# Altium project Dynamics Module v2.0.0.PrjPcb
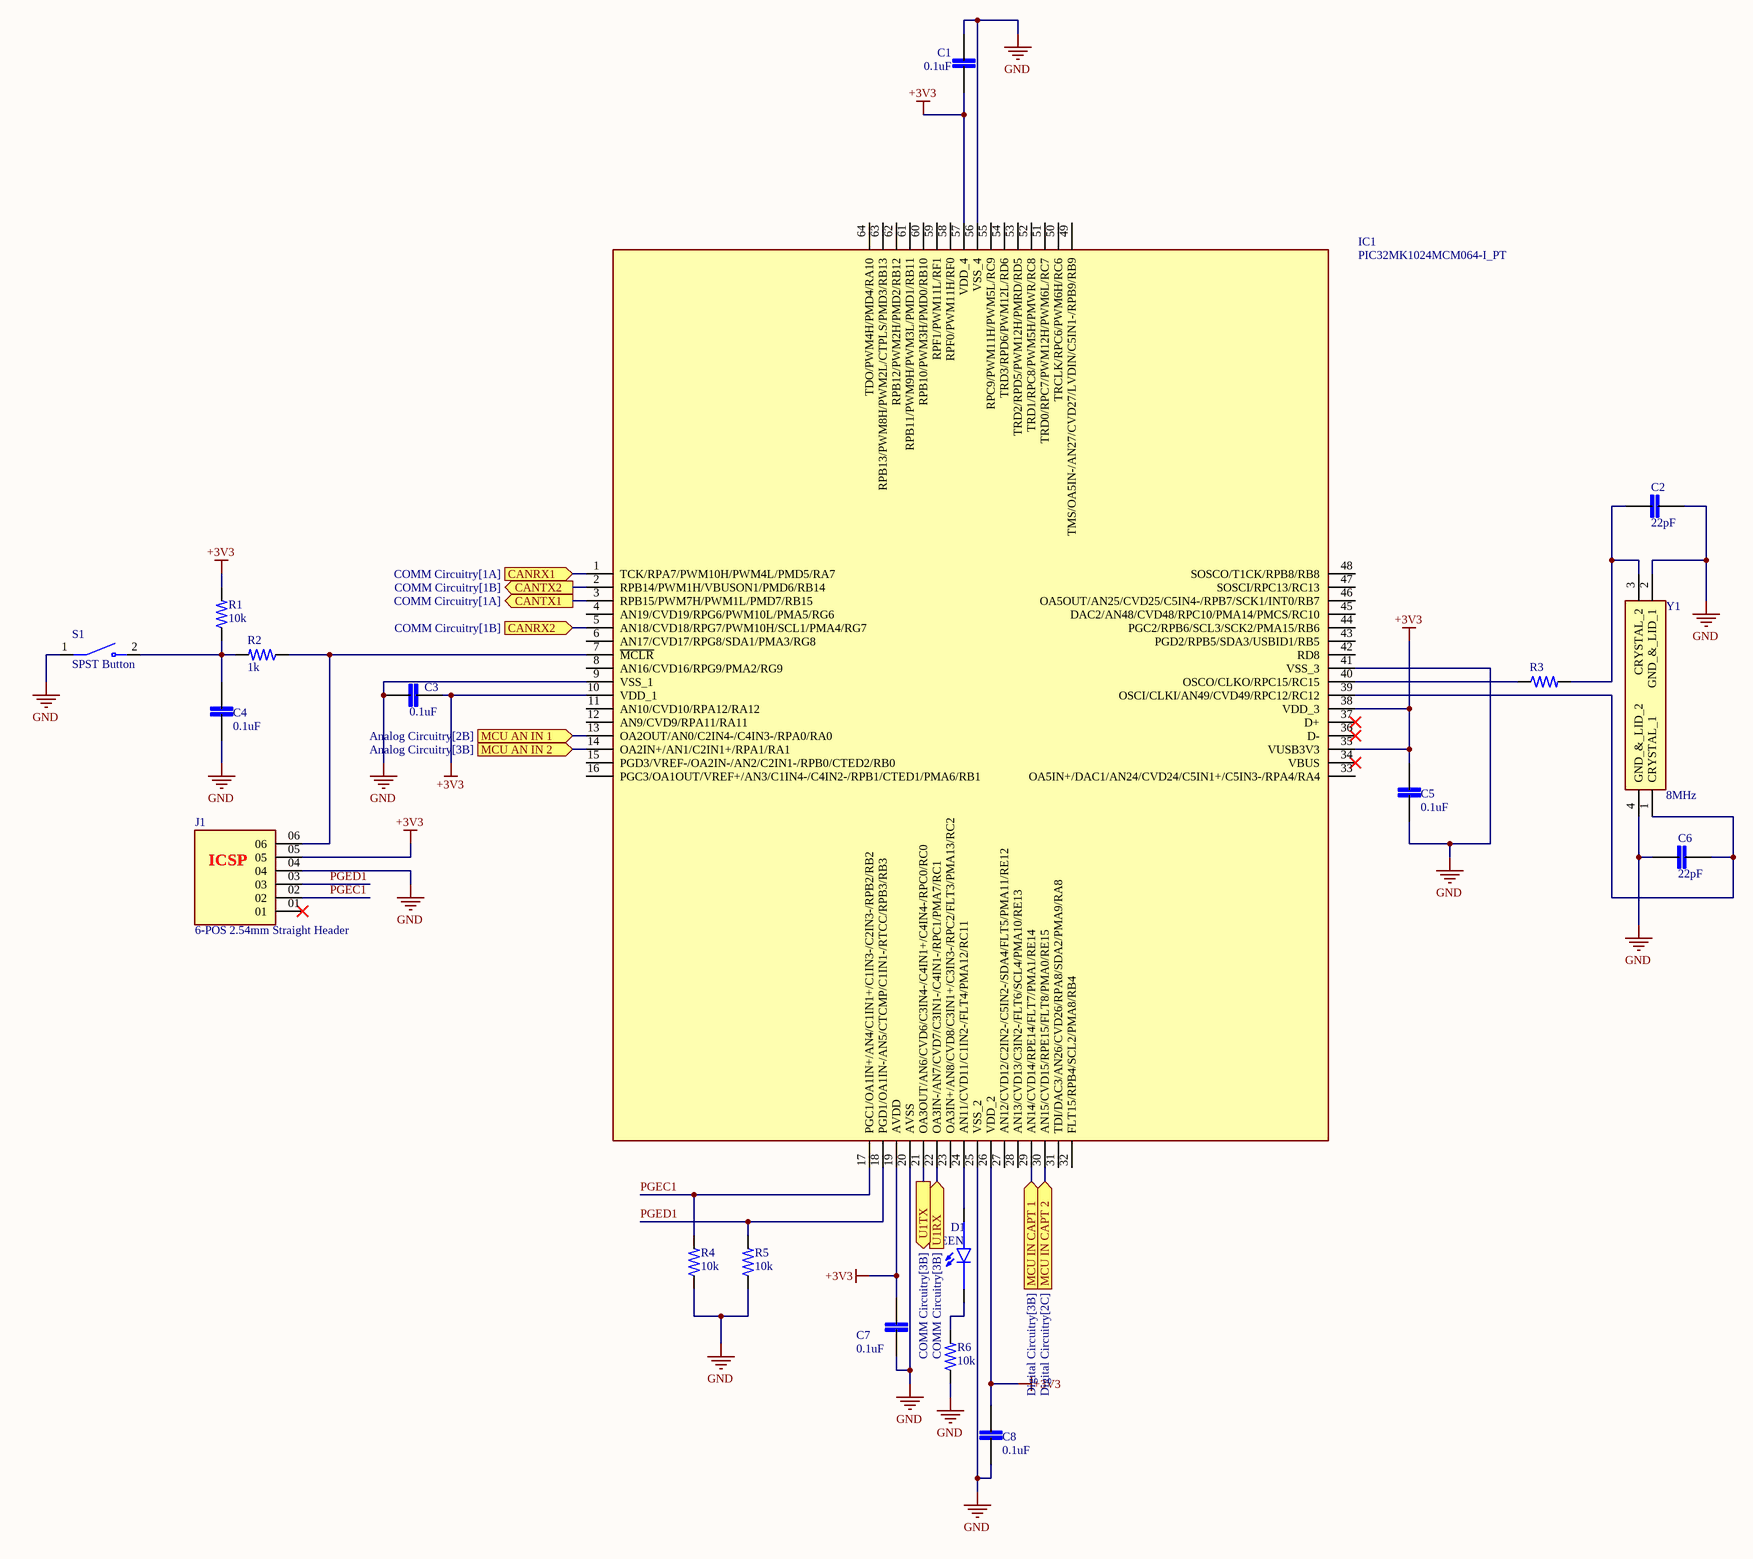
[diagram p0: PIC32MK1024MCM064.SchDoc]
6 sheets, 62 parts. Net scope: flat (ports and power ports of the same name join across sheets).
Board file: Dynamics Module v2.0.0.PcbDoc
Sheets:
  PIC32MK1024MCM064.SchDoc
  Analog Circuitry.SchDoc
  Digital Circuitry.SchDoc
  Power Circuitry.SchDoc
  COMM Circuitry.SchDoc
  Connector.SchDoc

## Sheet PIC32MK1024MCM064.SchDoc
size A2; SheetNumber: 1; SheetTotal: 6

### Parts
C1  0.1uF  [0805]
C2  22pF  [0805]
C3  0.1uF  [0805]
C4  0.1uF  [0805]
C5  0.1uF  [0805]
C6  22pF  [0805]
C7  0.1uF  [0805]
C8  0.1uF  [0805]
D1  GREEN  [LED 0805]
IC1  PIC32MK1024MCM064-I_PT  [PIC32MK1024MCM064-I_PT]
J1  6-POS 2.54mm Straight Header  [6-POS 2.54mm Header]
R1  10k  [0805]
R2  1k  [0805]
R3  0805_Resistor  [0805]  (value not drawn)
R4  10k  [0805]
R5  10k  [0805]
R6  10k  [0805]
S1  SPST Button  [SPST Button]
Y1  8MHz  [Crystal 5x3.2 - 4Pads]

### Ports
CANRX1 (in, see COMM Circuitry[1A]), CANRX2 (in, see COMM Circuitry[1B]), CANTX1 (out, see COMM Circuitry[1A]), CANTX2 (out, see COMM Circuitry[1B]), MCU AN IN 1 (in, see Analog Circuitry[2B]), MCU AN IN 2 (in, see Analog Circuitry[3B]), MCU IN CAPT 1 (in, see Digital Circuitry[3B]), MCU IN CAPT 2 (in, see Digital Circuitry[2C]), U1RX (in, see COMM Circuitry[3B]), U1TX (out, see COMM Circuitry[3B])

### Nets
+3V3: C1.2 C3.1 C5.2 C7.2 C8.2 IC1.10(VDD_1) IC1.19(AVDD) IC1.26(VDD_2) IC1.35(VUSB3V3) IC1.38(VDD_3) IC1.57(VDD_4) J1.05 R1.2
GND: C1.1 C2.2 C3.2 C4.1 C5.1 C6.1 C7.1 C8.1 IC1.9(VSS_1) IC1.20(AVSS) IC1.25(VSS_2) IC1.41(VSS_3) IC1.56(VSS_4) J1.04 R4.1 R5.1 R6.1 S1.1 Y1.2(GND_&_LID_1) Y1.4(GND_&_LID_2)
PGEC1: IC1.17(PGC1/OA1IN+/AN4/C1IN1+/C1IN3-/C2IN3-/RPB2/RB2) J1.02 R4.2
PGED1: IC1.18(PGD1/OA1IN-/AN5/CTCMP/C1IN1-/RTCC/RPB3/RB3) J1.03 R5.2
NetC2_1: C2.1 R3.2 Y1.3(CRYSTAL_2)
NetC4_2: C4.2 R1.1 R2.2 S1.2
NetC6_2: C6.2 IC1.39(OSCI/CLKI/AN49/CVD49/RPC12/RC12) Y1.1(CRYSTAL_1)
NetD1_A: D1.A IC1.24(AN11/CVD11/C1IN2-/FLT4/PMA12/RC11)
NetD1_C: D1.C R6.2
NetIC1_1: IC1.1(TCK/RPA7/PWM10H/PWM4L/PMD5/RA7) ; port CANRX1
NetIC1_2: IC1.2(RPB14/PWM1H/VBUSON1/PMD6/RB14) ; port CANTX2
NetIC1_3: IC1.3(RPB15/PWM7H/PWM1L/PMD7/RB15) ; port CANTX1
NetIC1_5: IC1.5(AN18/CVD18/RPG7/PWM10H/SCL1/PMA4/RG7) ; port CANRX2
NetIC1_7: IC1.7(~{MCLR}) J1.06 R2.1
NetIC1_13: IC1.13(OA2OUT/AN0/C2IN4-/C4IN3-/RPA0/RA0) ; port MCU AN IN 1
NetIC1_14: IC1.14(OA2IN+/AN1/C2IN1+/RPA1/RA1) ; port MCU AN IN 2
NetIC1_21: IC1.21(OA3OUT/AN6/CVD6/C3IN4-/C4IN1+/C4IN4-/RPC0/RC0) ; port U1TX
NetIC1_22: IC1.22(OA3IN-/AN7/CVD7/C3IN1-/C4IN1-/RPC1/PMA7/RC1) ; port U1RX
NetIC1_29: IC1.29(AN14/CVD14/RPE14/FLT7/PMA1/RE14) ; port MCU IN CAPT 1
NetIC1_30: IC1.30(AN15/CVD15/RPE15/FLT8/PMA0/RE15) ; port MCU IN CAPT 2
NetIC1_40: IC1.40(OSCO/CLKO/RPC15/RC15) R3.1

Not connected (* = marked no-connect by the designer): IC1 4(AN19/CVD19/RPG6/PWM10L/PMA5/RG6) 6(AN17/CVD17/RPG8/SDA1/PMA3/RG8) 8(AN16/CVD16/RPG9/PMA2/RG9) 11(AN10/CVD10/RPA12/RA12) 12(AN9/CVD9/RPA11/RA11) 15(PGD3/VREF-/OA2IN-/AN2/C2IN1-/RPB0/CTED2/RB0) 16(PGC3/OA1OUT/VREF+/AN3/C1IN4-/C4IN2-/RPB1/CTED1/PMA6/RB1) 23(OA3IN+/AN8/CVD8/C3IN1+/C3IN3-/RPC2/FLT3/PMA13/RC2) 27(AN12/CVD12/C2IN2-/C5IN2-/SDA4/FLT5/PMA11/RE12) 28(AN13/CVD13/C3IN2-/FLT6/SCL4/PMA10/RE13) 31(TDI/DAC3/AN26/CVD26/RPA8/SDA2/PMA9/RA8) 32(FLT15/RPB4/SCL2/PMA8/RB4) 33(OA5IN+/DAC1/AN24/CVD24/C5IN1+/C5IN3-/RPA4/RA4) 34(VBUS)* 36(D-)* 37(D+)* 42(RD8) 43(PGD2/RPB5/SDA3/USBID1/RB5) 44(PGC2/RPB6/SCL3/SCK2/PMA15/RB6) 45(DAC2/AN48/CVD48/RPC10/PMA14/PMCS/RC10) 46(OA5OUT/AN25/CVD25/C5IN4-/RPB7/SCK1/INT0/RB7) 47(SOSCI/RPC13/RC13) 48(SOSCO/T1CK/RPB8/RB8) 49(TMS/OA5IN-/AN27/CVD27/LVDIN/C5IN1-/RPB9/RB9) 50(TRCLK/RPC6/PWM6H/RC6) 51(TRD0/RPC7/PWM12H/PWM6L/RC7) 52(TRD1/RPC8/PWM5H/PMWR/RC8) 53(TRD2/RPD5/PWM12H/PMRD/RD5) 54(TRD3/RPD6/PWM12L/RD6) 55(RPC9/PWM11H/PWM5L/RC9) 58(RPF0/PWM11H/RF0) 59(RPF1/PWM11L/RF1) 60(RPB10/PWM3H/PMD0/RB10) 61(RPB11/PWM9H/PWM3L/PMD1/RB11) 62(RPB12/PWM2H/PMD2/RB12) 63(RPB13/PWM8H/PWM2L/CTPLS/PMD3/RB13) 64(TDO/PWM4H/PMD4/RA10); J1 01*

### Notes on the sheet
- (near J1) ICSP

### Library data of the parts
C1-C8 = 0805_Capacitor: MP: LD051A121KAB2A; MF: AVX; SnapEDA_Link: https://www.snapeda.com/parts/LD051A121KAB2A/AVX/view-part/?ref=snap; Package: 0805 AVX; Check_prices: https://www.snapeda.com/parts/LD051A121KAB2A/AVX/view-part/?ref=eda; Purchase-URL: https://pricing.snapeda.com/search/part/LD051A121KAB2A/?ref=eda; Price: None; Value: *; Availability: In Stock
D1 = LED 0805: LED Uni-Color Green 4-Pin Chip 0805 T/R; MP: 597-3305-607F; Availability: Unavailable; Value: *; Price: None; Package: None
IC1 = PIC32MK1024MCM064-I_PT: Integrated Circuit; Manufacturer_Name: Microchip; Manufacturer_Part_Number: PIC32MK1024MCM064-I/PT; Datasheet Link: https://ww1.microchip.com/downloads/aemDocuments/documents/MCU32/ProductDocuments/DataSheets/PIC32MK-GPK-MCM-with-CAN-FD-Family-DataSheet-DS60001519E.pdf; Height: 1.2mm; Mouser Part Number: 579-2MK1024MCM064IPT; Mouser Price/Stock: https://www.mouser.co.uk/ProductDetail/Microchip-Technology/PIC32MK1024MCM064-I-PT?qs=W%2FMpXkg%252BdQ4dBI32NJdQMg%3D%3D; Arrow Part Number: PIC32MK1024MCM064-I/PT; Arrow Price/Stock: https://www.arrow.com/en/products/pic32mk1024mcm064-ipt/microchip-technology?region=nac
J1 = 6-POS 2.54mm Straight Header: HEADER, 6 CONTACTS, 1 ROW, THROUGH HOLE, 2.54 MM; Connector Systems:Board-to-Board; Pitch Spacing:2.54mm; No. of Rows:1Rows; No. of Contacts:6Contacts; Contact Termination Type:Through Hole Right Angle; Product Range:HTSW Series RoHS Compliant: Yes; MP: HTSW10608SSLA; MF: Samtec; Purchase-URL: https://pricing.snapeda.com/search/part/HTSW10608SSLA/?ref=eda; Package: None; Check_prices: https://www.snapeda.com/parts/HTSW10608SSLA/Samtec/view-part/?ref=eda; Price: None; SnapEDA_Link: https://www.snapeda.com/parts/HTSW10608SSLA/Samtec/view-part/?ref=snap; Availability: In Stock; Value: *
R1-R6 = 0805_Resistor: Power_Rating: .25 W; MP: 2-2176053-0; Tolerance: 1%; Resistance: .33; MF: TE Connectivity; Price: None; Availability: In Stock; EU_RoHS_Compliance: Compliant with Exemptions; Package: 0805; Value: *; SnapEDA_Link: https://www.snapeda.com/parts/2-2176053-0/TE+Connectivity/view-part/?ref=snap; Check_prices: https://www.snapeda.com/parts/2-2176053-0/TE+Connectivity/view-part/?ref=eda
S1 = SPST Button: 3mmX6mm; MP: B3U-1000P; Price: None; Availability: Unavailable; Value: *; Package: None
Y1 = Crystal 5x3.2 - 4Pads: Crystal or Oscillator; Manufacturer_Name: Wurth Elektronik; Manufacturer_Part_Number: 830106162701; Datasheet Link: https://www.we-online.com/components/products/datasheet/830106162701.pdf; Height: 1mm; Mouser Part Number: 710-830106162701; Mouser Price/Stock: https://www.mouser.co.uk/ProductDetail/Wurth-Elektronik/830106162701?qs=hd1VzrDQEGiB2nVeND4SIw%3D%3D

## Sheet Analog Circuitry.SchDoc
size A4; SheetNumber: 2; SheetTotal: 6
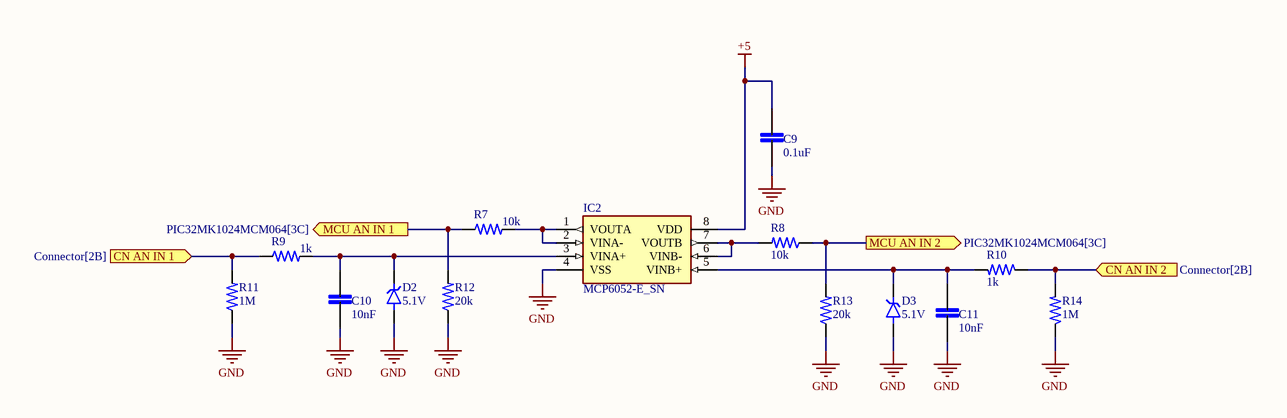
[diagram p1: Analog Circuitry.SchDoc]

### Parts
C9  0.1uF  [0805]
C10  10nF  [0805]
C11  10nF  [0805]
D2  5.1V  [SOD323]
D3  5.1V  [SOD323]
IC2  MCP6052-E_SN  [MCP6052-E_SN]
R7  10k  [0805]
R8  10k  [0805]
R9  1k  [0805]
R10  1k  [0805]
R11  1M  [0805]
R12  20k  [0805]
R13  20k  [0805]
R14  1M  [0805]

### Ports
CN AN IN 1 (in, see Connector[2B]), CN AN IN 2 (in, see Connector[2B]), MCU AN IN 1 (out, see PIC32MK1024MCM064[3C]), MCU AN IN 2 (out, see PIC32MK1024MCM064[3C])

### Nets
+5: C9.2 IC2.8(VDD)
GND: C9.1 C10.1 C11.1 D2.2(A) D3.2(A) IC2.4(VSS) R11.1 R12.1 R13.1 R14.1
NetC10_2: C10.2 D2.1(K) IC2.3(VINA+) R9.2
NetC11_2: C11.2 D3.1(K) IC2.5(VINB+) R10.2
NetIC1_13: R7.1 R12.2 ; port MCU AN IN 1
NetIC1_14: R8.1 R13.2 ; port MCU AN IN 2
NetIC2_1: IC2.1(VOUTA) IC2.2(VINA-) R7.2
NetIC2_6: IC2.6(VINB-) IC2.7(VOUTB) R8.2
NetJ3_2: R9.1 R11.2 ; port CN AN IN 1
NetJ3_5: R10.1 R14.2 ; port CN AN IN 2

### Library data of the parts
C9-C11 = 0805_Capacitor: MP: LD051A121KAB2A; MF: AVX; SnapEDA_Link: https://www.snapeda.com/parts/LD051A121KAB2A/AVX/view-part/?ref=snap; Package: 0805 AVX; Check_prices: https://www.snapeda.com/parts/LD051A121KAB2A/AVX/view-part/?ref=eda; Purchase-URL: https://pricing.snapeda.com/search/part/LD051A121KAB2A/?ref=eda; Price: None; Value: *; Availability: In Stock
D2 D3 = SOD323 - Zener Diode: MP: 1SMA5926; MF: Taiwan Semiconductor; Package: SMA-2 Taiwan Semiconductor; Availability: In Stock; Purchase-URL: https://pricing.snapeda.com/search/part/1SMA5926/?ref=eda; SnapEDA_Link: https://www.snapeda.com/parts/1SMA5926/Taiwan+Semiconductor/view-part/?ref=snap; Price: None; Check_prices: https://www.snapeda.com/parts/1SMA5926/Taiwan+Semiconductor/view-part/?ref=eda; Value: *
IC2 = MCP6052-E_SN: Integrated Circuit; Manufacturer_Name: Microchip; Manufacturer_Part_Number: MCP6052-E/SN; Datasheet Link: http://ww1.microchip.com/downloads/en/DeviceDoc/MCP6051_DS22182B.pdf; Height: 1.75mm; Mouser Part Number: 579-MCP6052-E/SN; Mouser Price/Stock: https://www.mouser.com/Search/Refine.aspx?Keyword=579-MCP6052-E%2FSN
R7-R14 = 0805_Resistor: as R1 on sheet PIC32MK1024MCM064; Price: None; Availability: In Stock; EU_RoHS_Compliance: Compliant with Exemptions; Package: 0805; Value: *; SnapEDA_Link: https://www.snapeda.com/parts/2-2176053-0/TE+Connectivity/view-part/?ref=snap; Check_prices: https://www.snapeda.com/parts/2-2176053-0/TE+Connectivity/view-part/?ref=eda

## Sheet Digital Circuitry.SchDoc
size A4; SheetNumber: 3; SheetTotal: 6
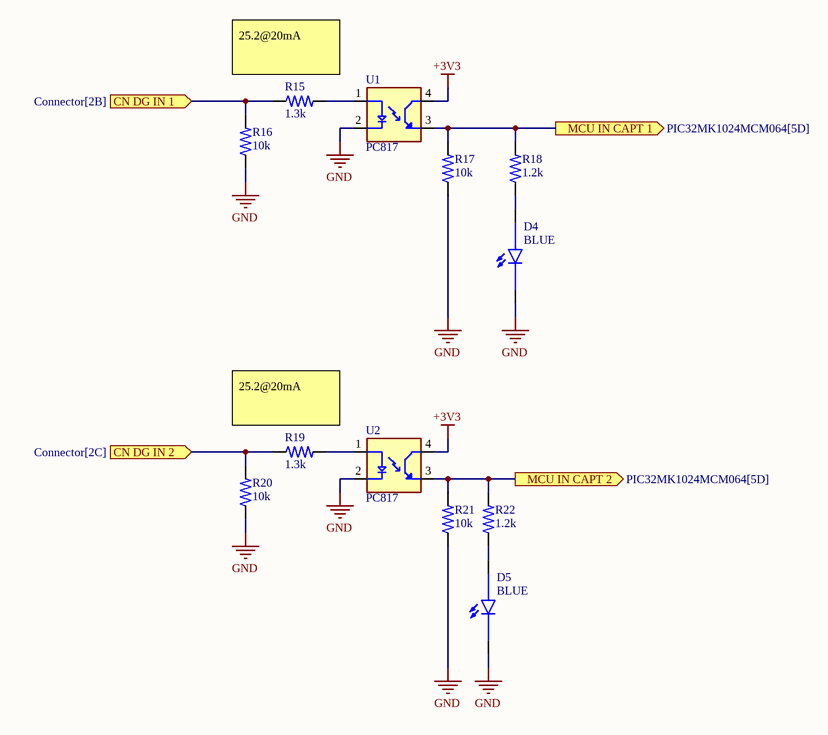
[diagram p2: Digital Circuitry.SchDoc]

### Parts
D4  BLUE  [LED 0805]
D5  BLUE  [LED 0805]
R15  1.3k  [0805]
R16  10k  [0805]
R17  10k  [0805]
R18  1.2k  [0805]
R19  1.3k  [0805]
R20  10k  [0805]
R21  10k  [0805]
R22  1.2k  [0805]
U1  PC817  [PC817]
U2  PC817  [PC817]

### Ports
CN DG IN 1 (in, see Connector[2B]), CN DG IN 2 (in, see Connector[2C]), MCU IN CAPT 1 (out, see PIC32MK1024MCM064[5D]), MCU IN CAPT 2 (out, see PIC32MK1024MCM064[5D])

### Nets
+3V3: U1.4(CT) U2.4(CT)
GND: D4.C D5.C R16.1 R17.1 R20.1 R21.1 U1.2(C) U2.2(C)
NetD4_A: D4.A R18.1
NetD5_A: D5.A R22.1
NetIC1_29: R17.2 R18.2 U1.3(ET) ; port MCU IN CAPT 1
NetIC1_30: R21.2 R22.2 U2.3(ET) ; port MCU IN CAPT 2
NetJ3_8: R15.1 R16.2 ; port CN DG IN 1
NetJ3_11: R19.1 R20.2 ; port CN DG IN 2
NetR15_2: R15.2 U1.1(A)
NetR19_2: R19.2 U2.1(A)

### Notes on the sheet
- 25.2@20mA

### Library data of the parts
D4 D5 = LED 0805: as D1 on sheet PIC32MK1024MCM064; Availability: Unavailable; Value: *; Price: None; Package: None
R15-R22 = 0805_Resistor: as R1 on sheet PIC32MK1024MCM064; Price: None; Availability: In Stock; EU_RoHS_Compliance: Compliant with Exemptions; Package: 0805; Value: *; SnapEDA_Link: https://www.snapeda.com/parts/2-2176053-0/TE+Connectivity/view-part/?ref=snap; Check_prices: https://www.snapeda.com/parts/2-2176053-0/TE+Connectivity/view-part/?ref=eda
U1 U2 = PC817: Optoisolator Transistor Output 5000Vrms 1 Channel 4-SMD; MP: PC817XI; MF: Sharp Microelectronics; Price: None; Availability: In Stock; Package: SMD-4 Sharp Microelectronics; Value: *; SnapEDA_Link: https://www.snapeda.com/parts/PC817XI/Sharp+Microelectronics/view-part/?ref=snap; Purchase-URL: https://pricing.snapeda.com/search/part/PC817XI/?ref=eda; Check_prices: https://www.snapeda.com/parts/PC817XI/Sharp+Microelectronics/view-part/?ref=eda

## Sheet Power Circuitry.SchDoc
size A4; SheetNumber: 4; SheetTotal: 6
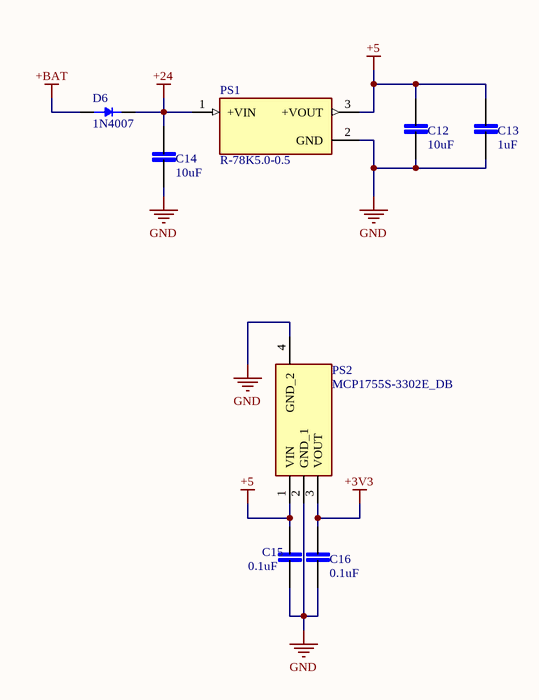
[diagram p3: Power Circuitry.SchDoc]

### Parts
C12  10uF  [0805]
C13  1uF  [0805]
C14  10uF  [0805]
C15  0.1uF  [0805]
C16  0.1uF  [0805]
D6  1N4007  [SOD123]
PS1  R-78K5.0-0.5  [CONV_R-78K5.0-0.5]
PS2  MCP1755S-3302E_DB  [MCP1755S-3302E_DB]

### Nets
+3V3: C16.2 PS2.3(VOUT)
+5: C12.2 C13.2 C15.2 PS1.3(+VOUT) PS2.1(VIN)
+24: C14.2 D6.2(A) PS1.1(+VIN)
+BAT: D6.1(K)
GND: C12.1 C13.1 C14.1 C15.1 C16.1 PS1.2(GND) PS2.2(GND_1) PS2.4(GND_2)

### Library data of the parts
C12-C16 = 0805_Capacitor: MP: LD051A121KAB2A; MF: AVX; SnapEDA_Link: https://www.snapeda.com/parts/LD051A121KAB2A/AVX/view-part/?ref=snap; Package: 0805 AVX; Check_prices: https://www.snapeda.com/parts/LD051A121KAB2A/AVX/view-part/?ref=eda; Purchase-URL: https://pricing.snapeda.com/search/part/LD051A121KAB2A/?ref=eda; Price: None; Value: *; Availability: In Stock
D6 = SOD123 - Rectifier Diode: MF: Diodes Inc.; MP: 1N4148W-7-F; Value: *; Availability: In Stock; Package: SOD-123 Fairchild Semiconductor; SnapEDA_Link: https://www.snapeda.com/parts/1N4148W-7-F/Diodes+Inc./view-part/?ref=snap; Price: None; Check_prices: https://www.snapeda.com/parts/1N4148W-7-F/Diodes+Inc./view-part/?ref=eda; Purchase-URL: https://pricing.snapeda.com/search/part/1N4148W-7-F/?ref=eda
PS1 = R-78K5.0-0.5: 0.5A DC/DC-Converter 'INNOLINE' SIP3 reg; MF: Recom Power; Package: None; Value: *; Check_prices: https://www.snapeda.com/parts/R-78K5.0-0.5/Recom+Power/view-part/?ref=eda; Purchase-URL: https://pricing.snapeda.com/search/part/R-78K5.0-0.5/?ref=eda; Availability: In Stock; SnapEDA_Link: https://www.snapeda.com/parts/R-78K5.0-0.5/Recom+Power/view-part/?ref=snap; Price: None; MP: R-78K5.0-0.5
PS2 = MCP1755S-3302E_DB: Power Supply; Manufacturer_Name: Microchip; Manufacturer_Part_Number: MCP1755S-3302E/DB; Datasheet Link: http://www.farnell.com/datasheets/1697992.pdf; Height: 1.8mm; Mouser Part Number: 579-MCP1755S-3302EDB; Mouser Price/Stock: https://www.mouser.co.uk/ProductDetail/Microchip-Technology/MCP1755S-3302E-DB?qs=OCR3PNzn1cc7Hxpx9CIZgA%3D%3D; Arrow Part Number: MCP1755S-3302E/DB; Arrow Price/Stock: https://www.arrow.com/en/products/mcp1755s-3302edb/microchip-technology?region=nac

## Sheet COMM Circuitry.SchDoc
size A4; SheetNumber: 5; SheetTotal: 6
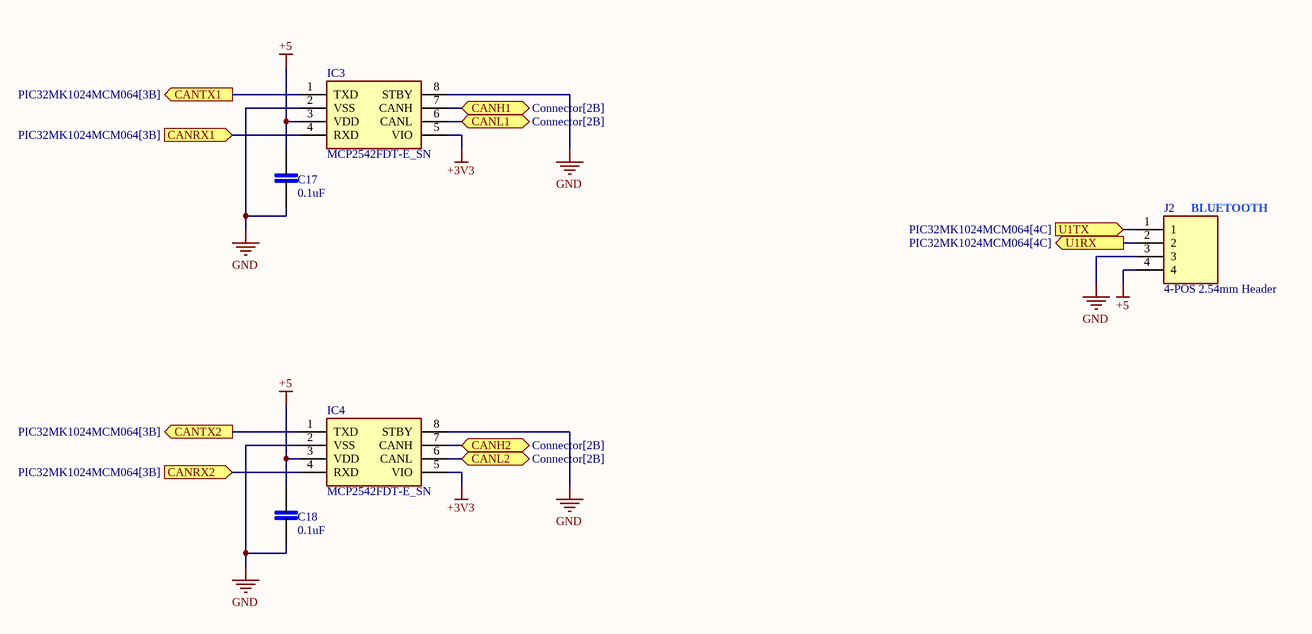
[diagram p4: COMM Circuitry.SchDoc]

### Parts
C17  0.1uF  [0805]
C18  0.1uF  [0805]
IC3  MCP2542FDT-E_SN  [MCP2542FDT-E_SN]
IC4  MCP2542FDT-E_SN  [MCP2542FDT-E_SN]
J2  4-POS 2.54mm Header  [4-POS 2.54mm Header]

### Ports
CANH1 (bidir, see Connector[2B]), CANH2 (bidir, see Connector[2B]), CANL1 (bidir, see Connector[2B]), CANL2 (bidir, see Connector[2B]), CANRX1 (in, see PIC32MK1024MCM064[3B]), CANRX2 (in, see PIC32MK1024MCM064[3B]), CANTX1 (out, see PIC32MK1024MCM064[3B]), CANTX2 (out, see PIC32MK1024MCM064[3B]), U1RX (out, see PIC32MK1024MCM064[4C]), U1TX (in, see PIC32MK1024MCM064[4C])

### Nets
+3V3: IC3.5(VIO) IC4.5(VIO)
+5: C17.2 C18.2 IC3.3(VDD) IC4.3(VDD) J2.4
GND: C17.1 C18.1 IC3.2(VSS) IC3.8(STBY) IC4.2(VSS) IC4.8(STBY) J2.3
NetIC1_1: IC3.4(RXD) ; port CANRX1
NetIC1_2: IC4.1(TXD) ; port CANTX2
NetIC1_3: IC3.1(TXD) ; port CANTX1
NetIC1_5: IC4.4(RXD) ; port CANRX2
NetIC1_21: J2.1 ; port U1TX
NetIC1_22: J2.2 ; port U1RX
NetIC3_6: IC3.6(CANL) ; port CANL1
NetIC3_7: IC3.7(CANH) ; port CANH1
NetIC4_6: IC4.6(CANL) ; port CANL2
NetIC4_7: IC4.7(CANH) ; port CANH2

### Notes on the sheet
- (near J2) BLUETOOTH

### Library data of the parts
C17 C18 = 0805_Capacitor: MP: LD051A121KAB2A; MF: AVX; SnapEDA_Link: https://www.snapeda.com/parts/LD051A121KAB2A/AVX/view-part/?ref=snap; Package: 0805 AVX; Check_prices: https://www.snapeda.com/parts/LD051A121KAB2A/AVX/view-part/?ref=eda; Purchase-URL: https://pricing.snapeda.com/search/part/LD051A121KAB2A/?ref=eda; Price: None; Value: *; Availability: In Stock
IC3 IC4 = MCP2542FDT-E_SN: Integrated Circuit; Manufacturer_Name: Microchip; Manufacturer_Part_Number: MCP2542FDT-E/SN; Datasheet Link: https://ww1.microchip.com/downloads/en/DeviceDoc/MCP2542FD-MCP2542WFD-4WFD-Data-Sheet-DS20005514C.pdf; Height: 1.75mm; Mouser Part Number: 579-MCP2542FDT-E/SN; Mouser Price/Stock: https://www.mouser.co.uk/ProductDetail/Microchip-Technology/MCP2542FDT-E-SN?qs=qdgZG5p0FZ7dgTYBMrlrQQ%3D%3D; Arrow Part Number: MCP2542FDT-E/SN; Arrow Price/Stock: https://www.arrow.com/en/products/mcp2542fdt-esn/microchip-technology?region=nac
J2 = 4-POS 2.54mm Header: MP: 5-146290-4; Package: None; Price: None; Value: *; Availability: Unavailable

## Sheet Connector.SchDoc
size A4; SheetNumber: 6; SheetTotal: 6
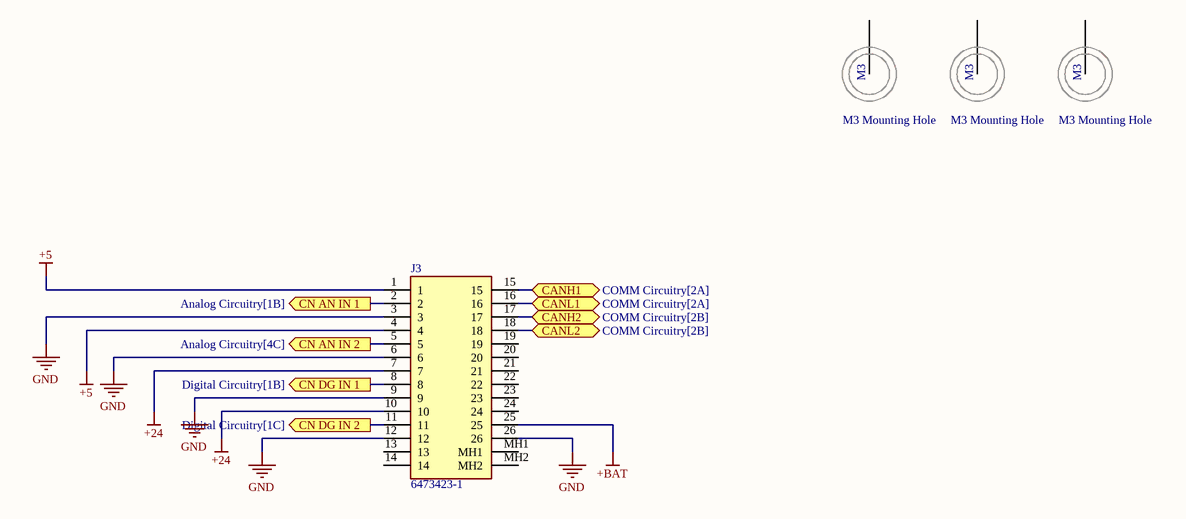
[diagram p5: Connector.SchDoc]

### Parts
(Parts that share a designator on the sheet are numbered #1, #2 ... from top to bottom, then left to right.)
#1  M3 Mounting Hole  [M3 - Mounting Hole]
#2  M3 Mounting Hole  [M3 - Mounting Hole]
#3  M3 Mounting Hole  [M3 - Mounting Hole]
J3  6473423-1  [64734231]

### Ports
CANH1 (bidir, see COMM Circuitry[2A]), CANH2 (bidir, see COMM Circuitry[2B]), CANL1 (bidir, see COMM Circuitry[2A]), CANL2 (bidir, see COMM Circuitry[2B]), CN AN IN 1 (out, see Analog Circuitry[1B]), CN AN IN 2 (out, see Analog Circuitry[4C]), CN DG IN 1 (out, see Digital Circuitry[1B]), CN DG IN 2 (out, see Digital Circuitry[1C])

### Nets
+5: J3.1 J3.4
+24: J3.7 J3.10
+BAT: J3.25
GND: J3.3 J3.6 J3.9 J3.12 J3.26
NetIC3_6: J3.16 ; port CANL1
NetIC3_7: J3.15 ; port CANH1
NetIC4_6: J3.18 ; port CANL2
NetIC4_7: J3.17 ; port CANH2
NetJ3_2: J3.2 ; port CN AN IN 1
NetJ3_5: J3.5 ; port CN AN IN 2
NetJ3_8: J3.8 ; port CN DG IN 1
NetJ3_11: J3.11 ; port CN DG IN 2

Not connected (* = marked no-connect by the designer): #1 1(M3); #2 1(M3); #3 1(M3); J3 13 14 19 20 21 22 23 24 MH1 MH2

### Library data of the parts
J3 = 6473423-1: Connector; Manufacturer_Name: TE Connectivity; Datasheet Link: https://www.te.com/commerce/DocumentDelivery/DDEController?Action=showdoc&DocId=Customer+Drawing%7F9-1437287-8%7FA1%7Fpdf%7FEnglish%7FENG_CD_9-1437287-8_A1.pdf%7F6473423-1; Height: 27.9mm; Manufacturer_Part_Number: 6473423-1; Mouser Part Number: 571-6473423-1; Mouser Price/Stock: https://www.mouser.co.uk/ProductDetail/TE-Connectivity/6473423-1?qs=XhI5AayaxxW9FyxB9N39mQ%3D%3D

## Nets that join several sheets
+3V3: PIC32MK1024MCM064 (13 pins), Digital Circuitry (U1.4 U2.4), Power Circuitry (C16.2 PS2.3), COMM Circuitry (IC3.5 IC4.5)
+5: Analog Circuitry (C9.2 IC2.8), Power Circuitry (5 pins), COMM Circuitry (5 pins), Connector (J3.1 J3.4)
+24: Power Circuitry (C14.2 D6.2 PS1.1), Connector (J3.7 J3.10)
+BAT: Power Circuitry (D6.1), Connector (J3.25)
GND: PIC32MK1024MCM064 (20 pins), Analog Circuitry (10 pins), Digital Circuitry (8 pins), Power Circuitry (8 pins), COMM Circuitry (7 pins), Connector (5 pins)
NetIC1_1: PIC32MK1024MCM064 (IC1.1), COMM Circuitry (IC3.4)
NetIC1_2: PIC32MK1024MCM064 (IC1.2), COMM Circuitry (IC4.1)
NetIC1_3: PIC32MK1024MCM064 (IC1.3), COMM Circuitry (IC3.1)
NetIC1_5: PIC32MK1024MCM064 (IC1.5), COMM Circuitry (IC4.4)
NetIC1_13: PIC32MK1024MCM064 (IC1.13), Analog Circuitry (R7.1 R12.2)
NetIC1_14: PIC32MK1024MCM064 (IC1.14), Analog Circuitry (R8.1 R13.2)
NetIC1_21: PIC32MK1024MCM064 (IC1.21), COMM Circuitry (J2.1)
NetIC1_22: PIC32MK1024MCM064 (IC1.22), COMM Circuitry (J2.2)
NetIC1_29: PIC32MK1024MCM064 (IC1.29), Digital Circuitry (R17.2 R18.2 U1.3)
NetIC1_30: PIC32MK1024MCM064 (IC1.30), Digital Circuitry (R21.2 R22.2 U2.3)
NetIC3_6: COMM Circuitry (IC3.6), Connector (J3.16)
NetIC3_7: COMM Circuitry (IC3.7), Connector (J3.15)
NetIC4_6: COMM Circuitry (IC4.6), Connector (J3.18)
NetIC4_7: COMM Circuitry (IC4.7), Connector (J3.17)
NetJ3_2: Analog Circuitry (R9.1 R11.2), Connector (J3.2)
NetJ3_5: Analog Circuitry (R10.1 R14.2), Connector (J3.5)
NetJ3_8: Digital Circuitry (R15.1 R16.2), Connector (J3.8)
NetJ3_11: Digital Circuitry (R19.1 R20.2), Connector (J3.11)